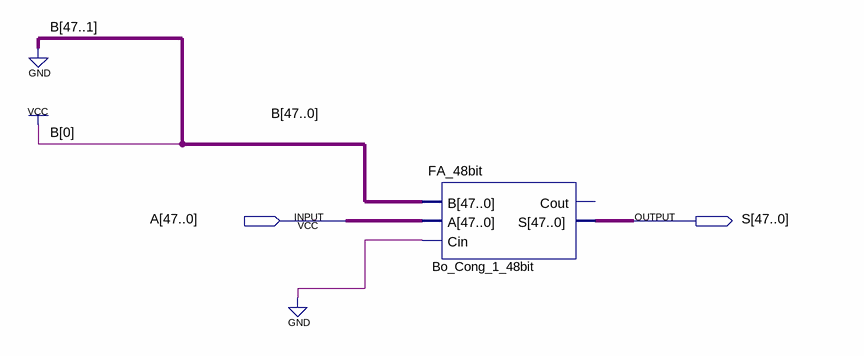
[diagram p0: schematic sheet]
// Quartus schematic BoCong_1_48bit.bdf as structural Verilog: 1 symbols, 2 pins
module BoCong_1_48bit (
  input  [47:0] A,
  output [47:0] S
);

  FA_48bit Bo_Cong_1_48bit (
    .B(48'b000000000000000000000000000000000000000000000001), .A(A), .Cin(1'b0), .S(S));  // open: Cout
endmodule
